# Altium schematic sheet POWER.SchDoc
size 297 x 209 mm
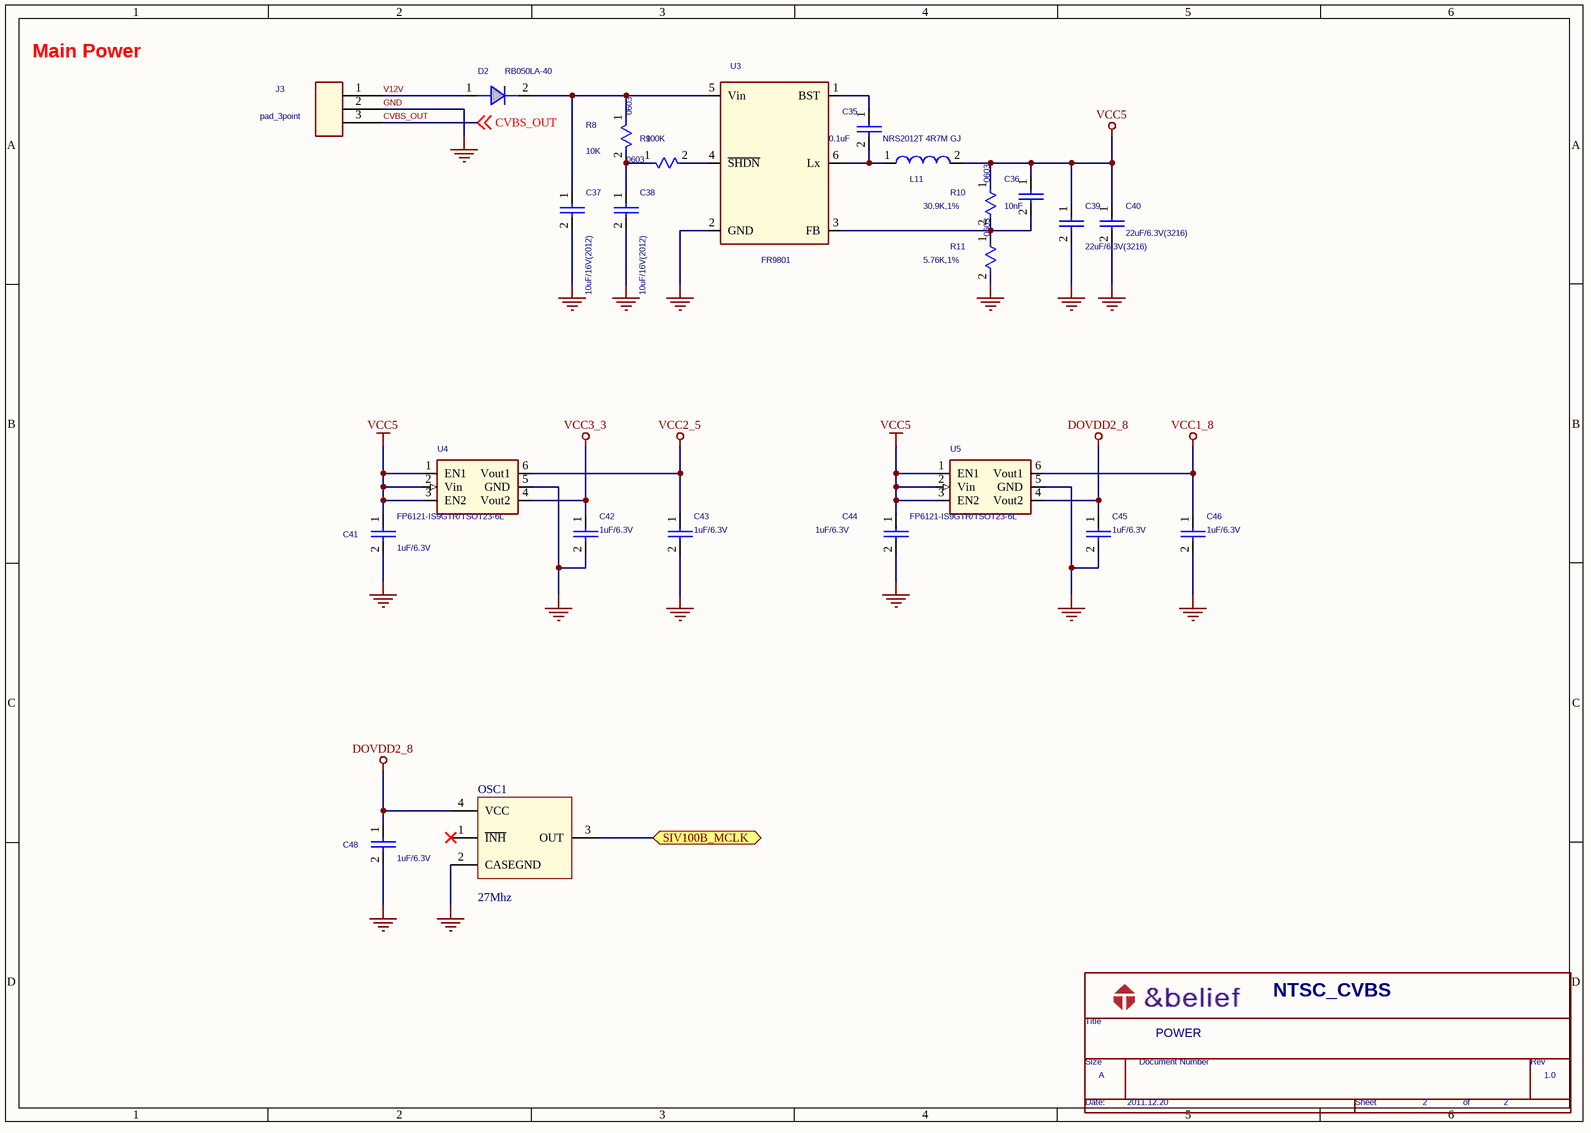
[diagram p0: POWER.SchDoc]

## Parts
*  Page Modify Date: 2011.12.20  RevCode: 1.0  Title: POWER  OrgName: NTSC_CVBS  Page Size: A  Page Number: 2  (hidden comment: TnBelief)  (graphical)
C35  0.1uF  [CAPC1005X55N]
C36  10nF  [CAPC1005X55N]
C37  10uF/16V(2012)  [CAPC2012X135N]
C38  10uF/16V(2012)  [CAPC2012X135N]
C39  22uF/6.3V(3216)  [CAPC3216X100N]
C40  22uF/6.3V(3216)  [CAPC3216X100N]
C41  1uF/6.3V  [CAPC1608X90N]
C42  1uF/6.3V  [CAPC1608X90N]
C43  1uF/6.3V  [CAPC1608X90N]
C44  1uF/6.3V  [CAPC1608X90N]
C45  1uF/6.3V  [CAPC1608X90N]
C46  1uF/6.3V  [CAPC1608X90N]
C48  1uF/6.3V  [CAPC1608X90N]
D2  RB050LA-40  [RB50LA-40]
J3  pad_3point  [Jump_3Way_Text1]
L11  NRS2012T 4R7M GJ  [INDC2016X180N]
OSC1  27Mhz  [XTAL-4pin-3225]
R8  10K  Size: 0603  [RESC1005X40N]
R9  100K  Size: 0603  [RESC1005X40N]
R10  30.9K,1%  Size: 0603  [RESC1005X40N]
R11  5.76K,1%  Size: 0603  [RESC1005X40N]
U3  FR9801  [SOT23-6]
U4  FP6121-IS9GTR/TSOT23-6L  [SOT23-6]
U5  FP6121-IS9GTR/TSOT23-6L  [SOT23-6]

## Ports
SIV100B_MCLK

## Nets
DOVDD2_8: C45.1 C48.1 OSC1.4(VCC) U5.4(Vout2)
GND: C37.2 C38.2 C39.2 C40.2 C41.2 C42.2 C43.2 C44.2 C45.2 C46.2 C48.2 J3.2 OSC1.2(CASEGND) R11.2 U3.2(GND) U4.5(GND) U5.5(GND)
VCC1_8: C46.1 U5.6(Vout1)
VCC2_5: C43.1 U4.6(Vout1)
VCC3_3: C42.1 U4.4(Vout2)
VCC5: C36.1 C39.1 C40.1 C41.1 C44.1 L11.2 R10.1 U4.1(EN1) U4.2(Vin) U4.3(EN2) U5.1(EN1) U5.2(Vin) U5.3(EN2)
CVBS_OUT: J3.3 ; off-sheet CVBS_OUT
SIV100B_MCLK: OSC1.3(OUT) ; port SIV100B_MCLK
V12V: D2.1 J3.1
NetC35_1: C35.1 U3.1(BST)
NetC35_2: C35.2 L11.1 U3.6(Lx)
NetC36_2: C36.2 R10.2 R11.1 U3.3(FB)
NetC37_1: C37.1 D2.2 R8.1 U3.5(Vin)
NetC38_1: C38.1 R8.2 R9.1
NetR9_2: R9.2 U3.4(~{SHDN})

Not connected (* = marked no-connect by the designer): OSC1 1(~{INH})*

## Notes on the sheet
- Main Power
- (in symbol TnBelief) Title; Size; Document Number; Rev; Date:; Sheet; of

## Library data of the parts
* = TnBelief: Doc: 2013. 05. 05 designed by ÀÌ  °­; Page Create Date: March  8, 1995; Page Count: 2
C35 = CAP NP_16
C36 = CAP NP_13
C37 = CAP NP_17
C38 = CAP NP_18
C39 = CAP NP_15
C40 = CAP NP_14
C41 C44 C48 = CAP NP_0
C42 C43 C45 C46 = CAP NP_1
D2 = DIODE PIN_1
J3 = CON3
L11 = INDUCTOR_0
OSC1 = XO_50Mhz_3V3_50ppm_SMD: OSC XO 50.000MHZ CMOS SMD
R8 R9 = 0R,1/10W,5%,0603_0: 0R,1/10W,5%,0603; Part Decal: R0603; Tolerance: ¡Ó5%; COMP_TYPE: SMD; Category: RES; Property A: 1/10W; Property B: 5%; Property C: 0603; Thickness: 0.55mm
R10 = 0R,1/10W,5%,0603_10: 0R,1/10W,5%,0603; Part Decal: R0603; Tolerance: ¡Ó5%; COMP_TYPE: SMD; Category: RES; Property A: 1/10W; Property B: 5%; Property C: 0603; Thickness: 0.55mm
R11 = 0R,1/10W,5%,0603_11: 0R,1/10W,5%,0603; Part Decal: R0603; Tolerance: ¡Ó5%; COMP_TYPE: SMD; Category: RES; Property A: 1/10W; Property B: 5%; Property C: 0603; Thickness: 0.55mm
U3 = R1244N001B_1
U4 U5 = IC DC/DC RT8258 SOT26_0